# Altium project solar_battery_tests.PrjPcb
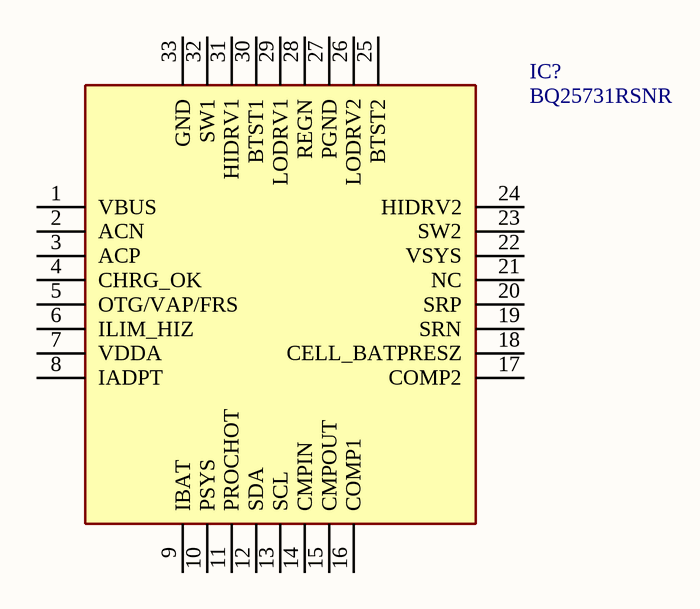
[diagram p0: test_sheet.SchDoc]
1 sheet, 1 parts. Net scope: global (net labels, ports and power ports of the same name join across sheets).
Board file: testPCB.PcbDoc

## Sheet test_sheet.SchDoc
size A4; SheetNumber: 1; SheetTotal: 1

### Parts
IC?  BQ25731RSNR  [QFN40P400X400X80-33N-D]

### Nets

Not connected (* = marked no-connect by the designer): IC? 1(VBUS) 2(ACN) 3(ACP) 4(CHRG_OK) 5(OTG/VAP/FRS) 6(ILIM_HIZ) 7(VDDA) 8(IADPT) 9(IBAT) 10(PSYS) 11(PROCHOT) 12(SDA) 13(SCL) 14(CMPIN) 15(CMPOUT) 16(COMP1) 17(COMP2) 18(CELL_BATPRESZ) 19(SRN) 20(SRP) 21(NC) 22(VSYS) 23(SW2) 24(HIDRV2) 25(BTST2) 26(LODRV2) 27(PGND) 28(REGN) 29(LODRV1) 30(BTST1) 31(HIDRV1) 32(SW1) 33(GND)

### Library data of the parts
IC? = BQ25731RSNR: Integrated Circuit; Manufacturer_Name: Texas Instruments; Datasheet Link: https://www.ti.com/lit/gpn/bq25731; Height: 0.8mm; Manufacturer_Part_Number: BQ25731RSNR; Mouser Part Number: 595-BQ25731RSNR; Mouser Price/Stock: https://www.mouser.co.uk/ProductDetail/Texas-Instruments/BQ25731RSNR?qs=stqOd1AaK7%2Fv1jry38xYIQ%3D%3D; Arrow Part Number: BQ25731RSNR; Arrow Price/Stock: https://www.arrow.com/en/products/bq25731rsnr/texas-instruments?region=nac